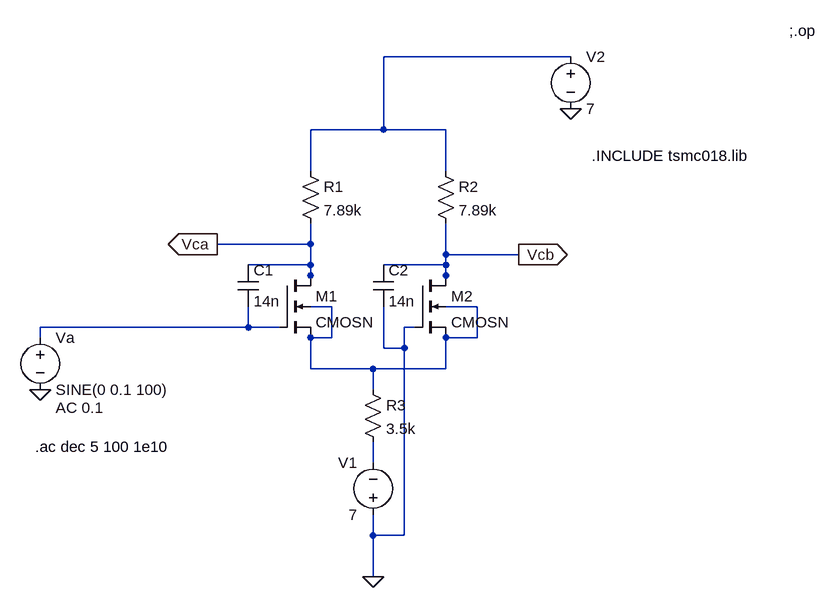
[diagram p0: schematic differential_amplifier.asc]
differential_amplifier.asc, the LTspice schematic file:
Version 4
SHEET 1 880 708
WIRE 320 -112 32 -112
WIRE 32 0 32 -112
WIRE 32 0 -80 0
WIRE 128 0 32 0
WIRE -80 64 -80 0
WIRE 128 64 128 0
WIRE -80 176 -80 144
WIRE -80 176 -224 176
WIRE 128 192 128 144
WIRE 240 192 128 192
WIRE -80 208 -80 176
WIRE -80 208 -176 208
WIRE 128 208 128 192
WIRE 128 208 32 208
WIRE -80 224 -80 208
WIRE 128 224 128 208
WIRE -80 240 -80 224
WIRE 128 240 128 224
WIRE -48 272 -80 272
WIRE 176 272 128 272
WIRE -176 304 -176 272
WIRE -176 304 -496 304
WIRE -128 304 -176 304
WIRE 80 304 64 304
WIRE -496 320 -496 304
WIRE -48 320 -48 272
WIRE -48 320 -80 320
WIRE 176 320 176 272
WIRE 176 320 128 320
WIRE 32 336 32 272
WIRE 64 336 64 304
WIRE 64 336 32 336
WIRE -80 368 -80 320
WIRE 16 368 -80 368
WIRE 128 368 128 320
WIRE 128 368 16 368
WIRE 16 400 16 368
WIRE 16 512 16 480
WIRE 16 624 16 592
WIRE 64 624 64 336
WIRE 64 624 16 624
WIRE 16 688 16 624
FLAG 16 688 0
FLAG 320 -32 0
FLAG -496 400 0
FLAG -224 176 Vca
IOPIN -224 176 Out
FLAG 240 192 Vcb
IOPIN 240 192 Out
SYMBOL cmosn -128 224 R0
SYMATTR InstName M1
SYMATTR Value2 l=510n w=550u
SYMBOL cmosn 80 224 R0
SYMATTR InstName M2
SYMATTR Value2 l=510n w=550u
SYMBOL res -96 48 R0
SYMATTR InstName R1
SYMATTR Value 7.89k
SYMBOL res 112 48 R0
SYMATTR InstName R2
SYMATTR Value 7.89k
SYMBOL voltage 16 608 R180
WINDOW 0 24 96 Left 2
WINDOW 3 24 16 Left 2
WINDOW 123 0 0 Left 0
WINDOW 39 0 0 Left 0
SYMATTR InstName V1
SYMATTR Value 7
SYMBOL voltage 320 -128 R0
WINDOW 123 0 0 Left 0
WINDOW 39 0 0 Left 0
SYMATTR InstName V2
SYMATTR Value 7
SYMBOL voltage -496 304 R0
WINDOW 123 24 124 Left 2
WINDOW 39 0 0 Left 0
SYMATTR InstName Va
SYMATTR Value SINE(0 0.1 100)
SYMATTR Value2 AC 0.1
SYMBOL res 0 384 R0
SYMATTR InstName R3
SYMATTR Value 3.5k
SYMBOL cap -192 208 R0
SYMATTR InstName C1
SYMATTR Value 14n
SYMBOL cap 16 208 R0
SYMATTR InstName C2
SYMATTR Value 14n
TEXT 352 40 Left 2 !.INCLUDE tsmc018.lib
TEXT 656 -152 Left 2 !;.op
TEXT -504 488 Left 2 !.ac dec 5 100 1e10

The netlist it stands for:
* differential_amplifier.asc
M1 Vca N003 N002 N002 CMOSN l=510n w=550u
M2 Vcb 0 N002 N002 CMOSN l=510n w=550u
R1 N001 Vca 7.89k
R2 N001 Vcb 7.89k
V1 0 N004 7
V2 N001 0 7
Va N003 0 SINE(0 0.1 100) AC 0.1
R3 N002 N004 3.5k
C1 Vca N003 14n
C2 Vcb 0 14n
.model NMOS NMOS
.model PMOS PMOS
.lib standard.mos
.INCLUDE tsmc018.lib
;.op
.ac dec 5 100 1e10
.backanno
.end